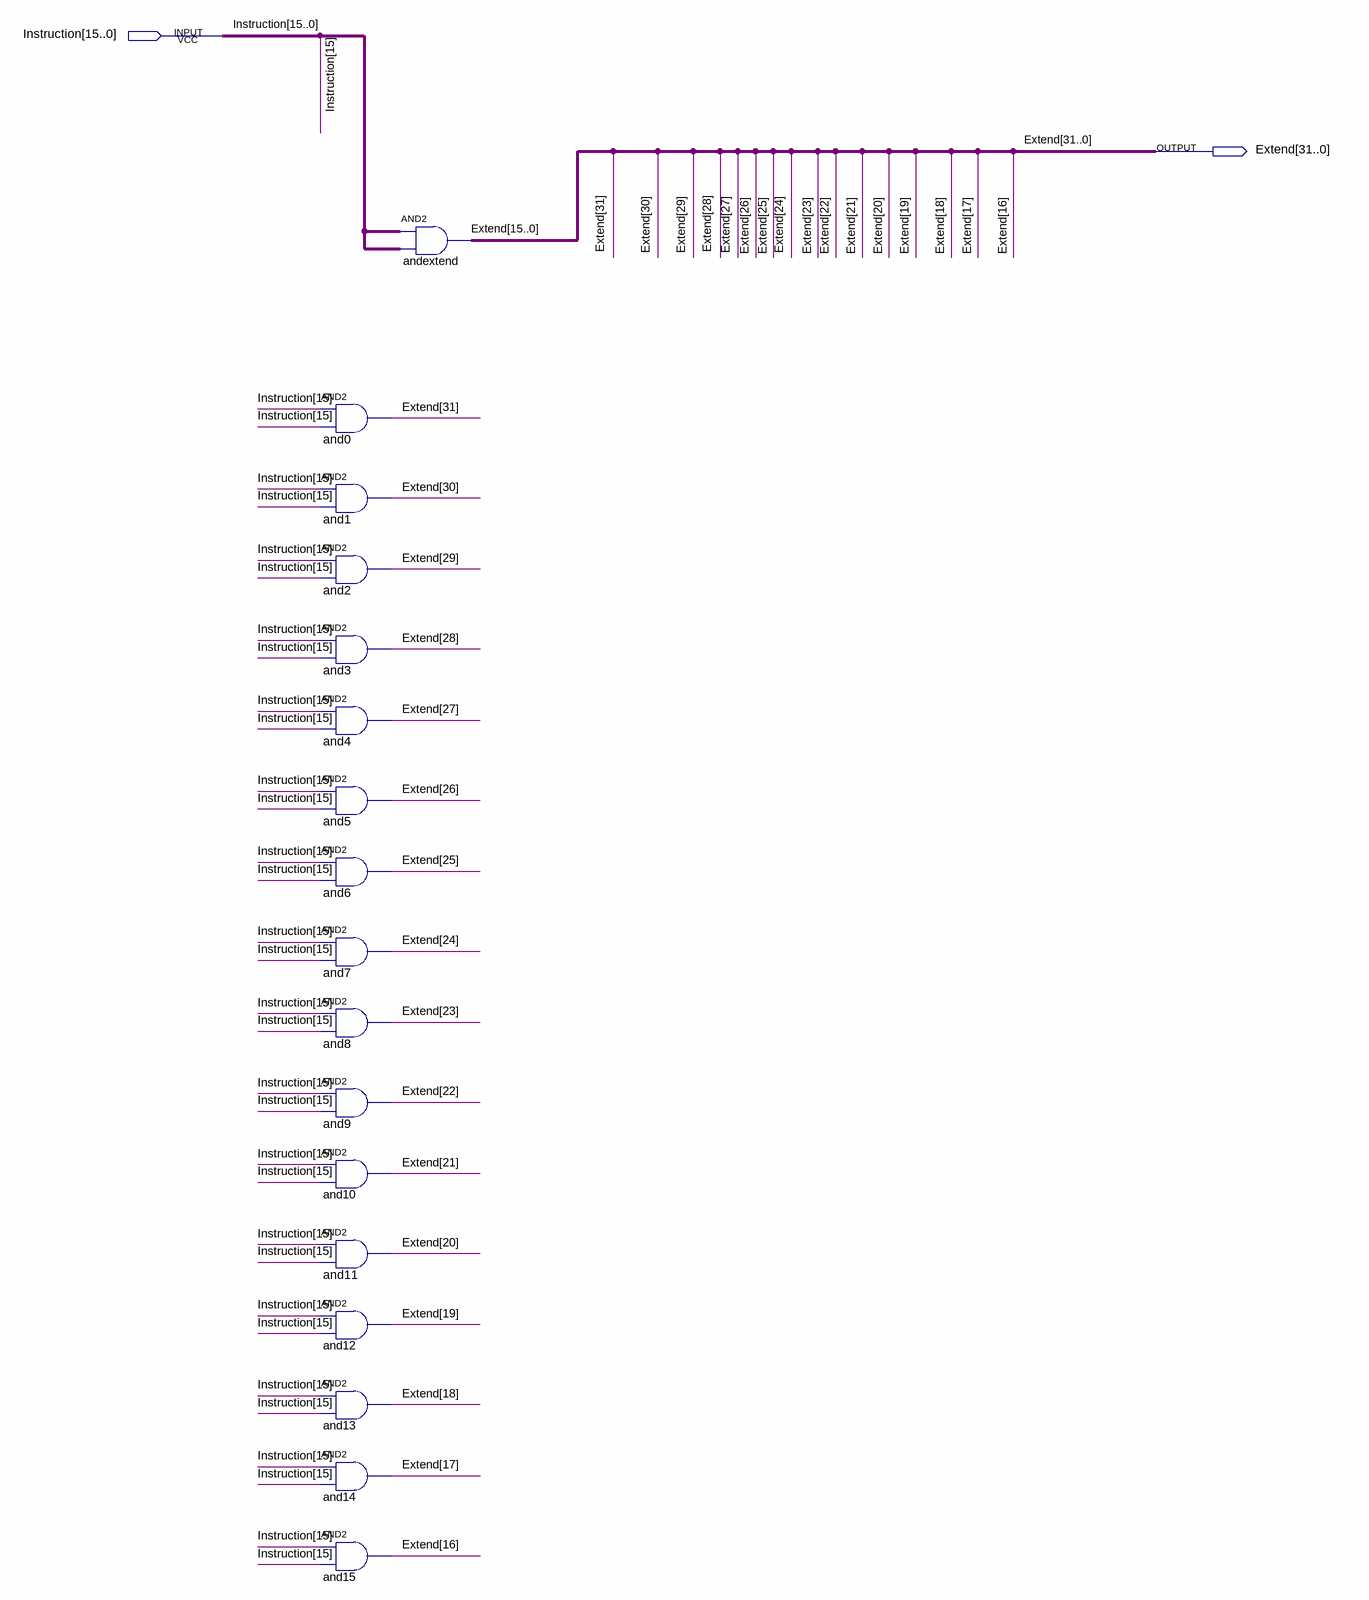
[diagram p0: schematic sheet]
// Quartus schematic SignExtend.bdf as structural Verilog: 17 symbols, 2 pins
module SignExtend (
  input  [15:0] Instruction,
  output [31:0] Extend
);

  and and0 (Extend[31], Instruction[15], Instruction[15]);
  and and1 (Extend[30], Instruction[15], Instruction[15]);
  and and2 (Extend[29], Instruction[15], Instruction[15]);
  and and3 (Extend[28], Instruction[15], Instruction[15]);
  and and4 (Extend[27], Instruction[15], Instruction[15]);
  and and5 (Extend[26], Instruction[15], Instruction[15]);
  and and6 (Extend[25], Instruction[15], Instruction[15]);
  and and7 (Extend[24], Instruction[15], Instruction[15]);
  and and8 (Extend[23], Instruction[15], Instruction[15]);
  and and9 (Extend[22], Instruction[15], Instruction[15]);
  and and10 (Extend[21], Instruction[15], Instruction[15]);
  and and11 (Extend[20], Instruction[15], Instruction[15]);
  and and12 (Extend[19], Instruction[15], Instruction[15]);
  and and13 (Extend[18], Instruction[15], Instruction[15]);
  and and14 (Extend[17], Instruction[15], Instruction[15]);
  and and15 (Extend[16], Instruction[15], Instruction[15]);
  assign Extend[15:0] = Instruction & Instruction;  // AND2 andextend, 16 bits wide
endmodule
